# EAGLE design Ghetto distortion 3 - Pablo Martín (EAGLE 8.6.0)
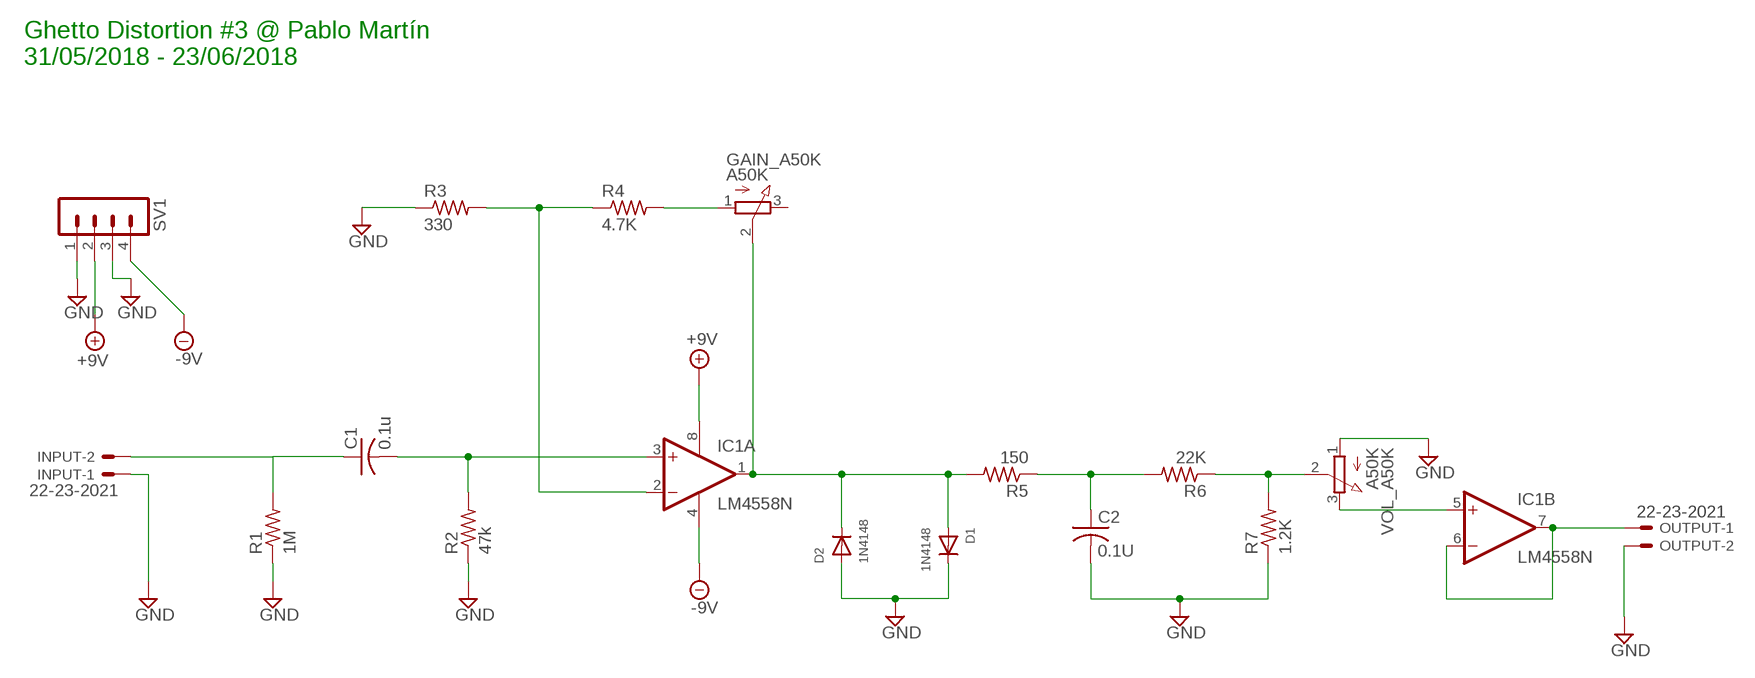
[diagram p0: schematic, sheet 1]

## Parts
C1  0.1u  C-US050-024X044  [C050-024X044]
C2  0.1U  C-US050-024X044  [C050-024X044]
D1  1N4148  DIODEDO-1N4148  [DO-1N4148]
D2  1N4148  DIODEDO-1N4148  [DO-1N4148]
GAIN_A50K  A50K  3RP/1610N  [3RP/1610N]
IC1  LM4558N  [DIL08]
INPUT  22-23-2021  [22-23-2021]
OUTPUT  22-23-2021  [22-23-2021]
R1  1M  R-US_0204/7  [0204/7]
R2  47k  R-US_0204/7  [0204/7]
R3  330  R-US_0204/7  [0204/7]
R4  4.7K  R-US_0204/7  [0204/7]
R5  150  R-US_0204/7  [0204/7]
R6  22K  R-US_0204/7  [0204/7]
R7  1.2K  R-US_0204/7  [0204/7]
SV1  MA04-1  [MA04-1]
VOL_A50K  A50K  3RP/1610N  [3RP/1610N]

## Nets
+9V: IC1.8(P:V+) SV1.2
-9V: IC1.4(P:V-) SV1.4
GND: C2.2 D1.C D2.A INPUT.1 OUTPUT.2 R1.1 R2.1 R3.1 R7.1 SV1.1 SV1.3 VOL_A50K.1(A)
N$1: C1.2 IC1.3(A:+IN) R2.2
N$2: C1.1 INPUT.2 R1.2
N$3: IC1.2(A:-IN) R3.2 R4.1
N$4: D1.A D2.C GAIN_A50K.2(S) IC1.1(A:OUT) R5.2
N$5: R6.1 R7.2 VOL_A50K.2(S)
N$6: IC1.5(B:+IN) VOL_A50K.3(E)
N$7: GAIN_A50K.1(A) R4.2
N$8: IC1.6(B:-IN) IC1.7(B:OUT) OUTPUT.1
N$9: C2.1 R5.1 R6.2
Unconnected: GAIN_A50K.3(E)

## Notes on the sheet
- Ghetto Distortion #3 @ Pablo Martín
  31/05/2018 - 23/06/2018

## Library data of the parts
C1 C2 = resistor:C-US: CAPACITOR, American symbol
D1 D2 = adafruit:DIODE: Diode SMADIODE - SMA Surface Mount Package 20V 1A Schottky Diode Digikey: 641-1014-6-ND DO-1N4148 - Through Hole Small Current Diode SOD-123 20V 1 A (.5mV Vf) Schottky Diode - Digikey: MBRX120TPMSCT-ND SOD-323 10V 570mA (.38mV Vf, 3ns) Schottky Diode - Digikey: ZLLS410CT-ND SOD-523 30V 30mA Schottky Diode (RB751S-40TE61) - Digikey: RB751S-40TE61CT-ND SOT23-R/W - SOT23 Package (R = Solder Paste/Reflow Ovens, W = Hand-Soldering) BAT54Film 40V 300mA - Digikey: 497-7162-1-ND
GAIN_A50K VOL_A50K = pot:3RP/1610N: 16mm Potentiometer one level Source: http://www.alphapotentiometers.net/html/16mm_pot_2.html
IC1 = linear:*4558: OP AMP; SPICEPREFIX: J
INPUT OUTPUT = con-molex:22-23-2021: .100" (2.54mm) Center Header - 2 Pin; MF: MOLEX; MPN: 22-23-2021; OC_FARNELL: 1462926; OC_NEWARK: 25C3832
R1-R7 = resistor:R-US_: RESISTOR, American symbol
SV1 = con-lstb:MA04-1: PIN HEADER; OC_FARNELL: unknown; OC_NEWARK: unknown

## Net classes
0 default: clearance 0.205 mm

## Board
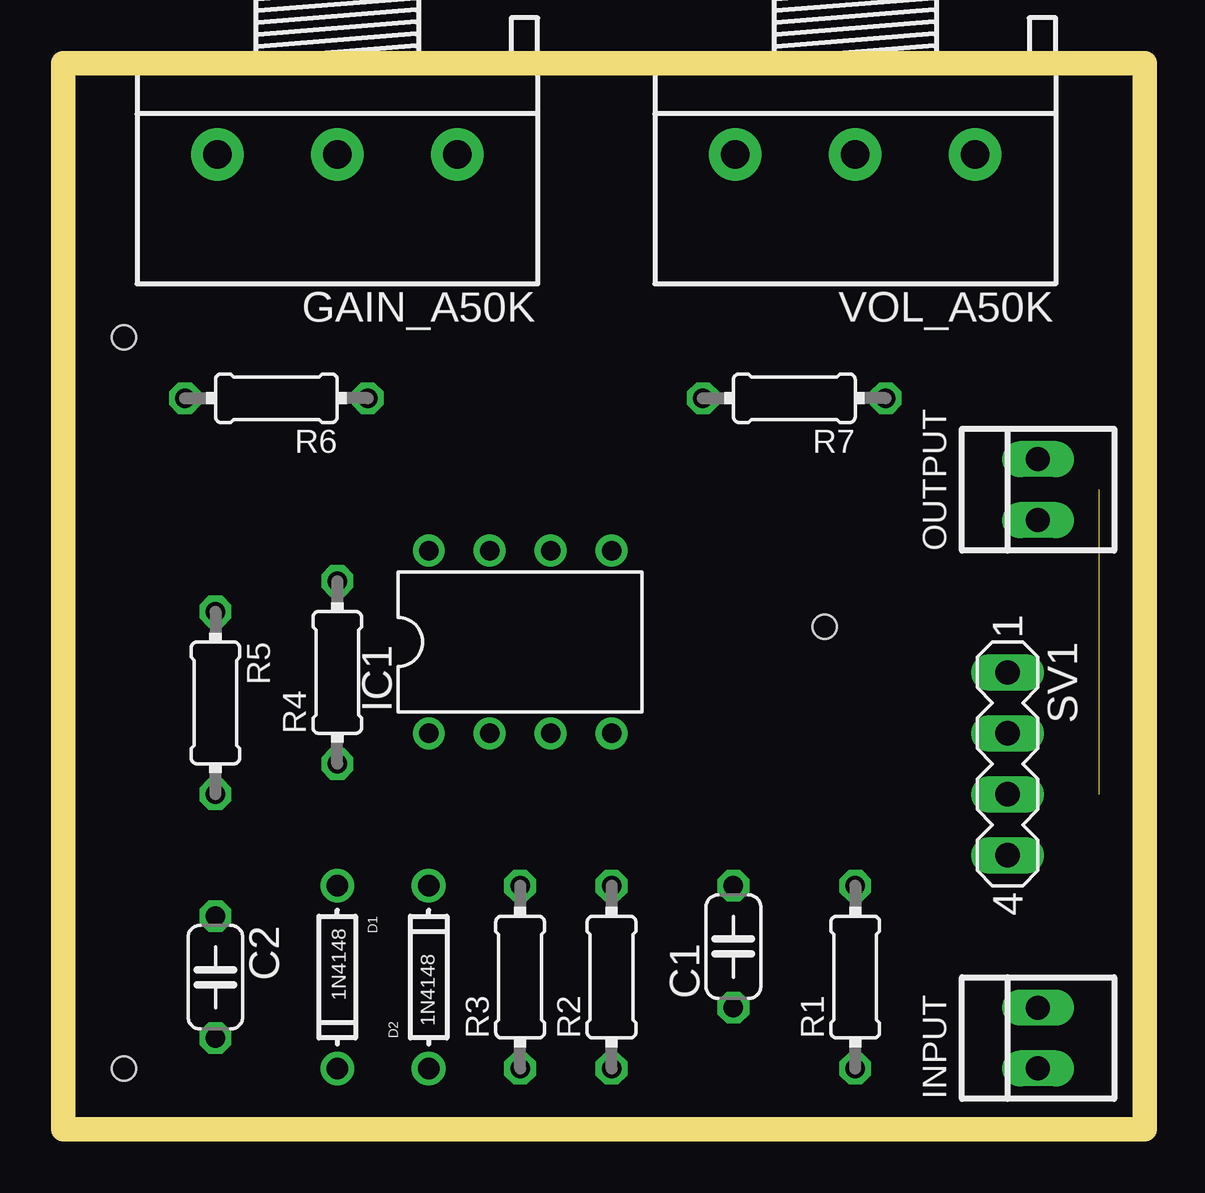
[diagram p1: board, top side]
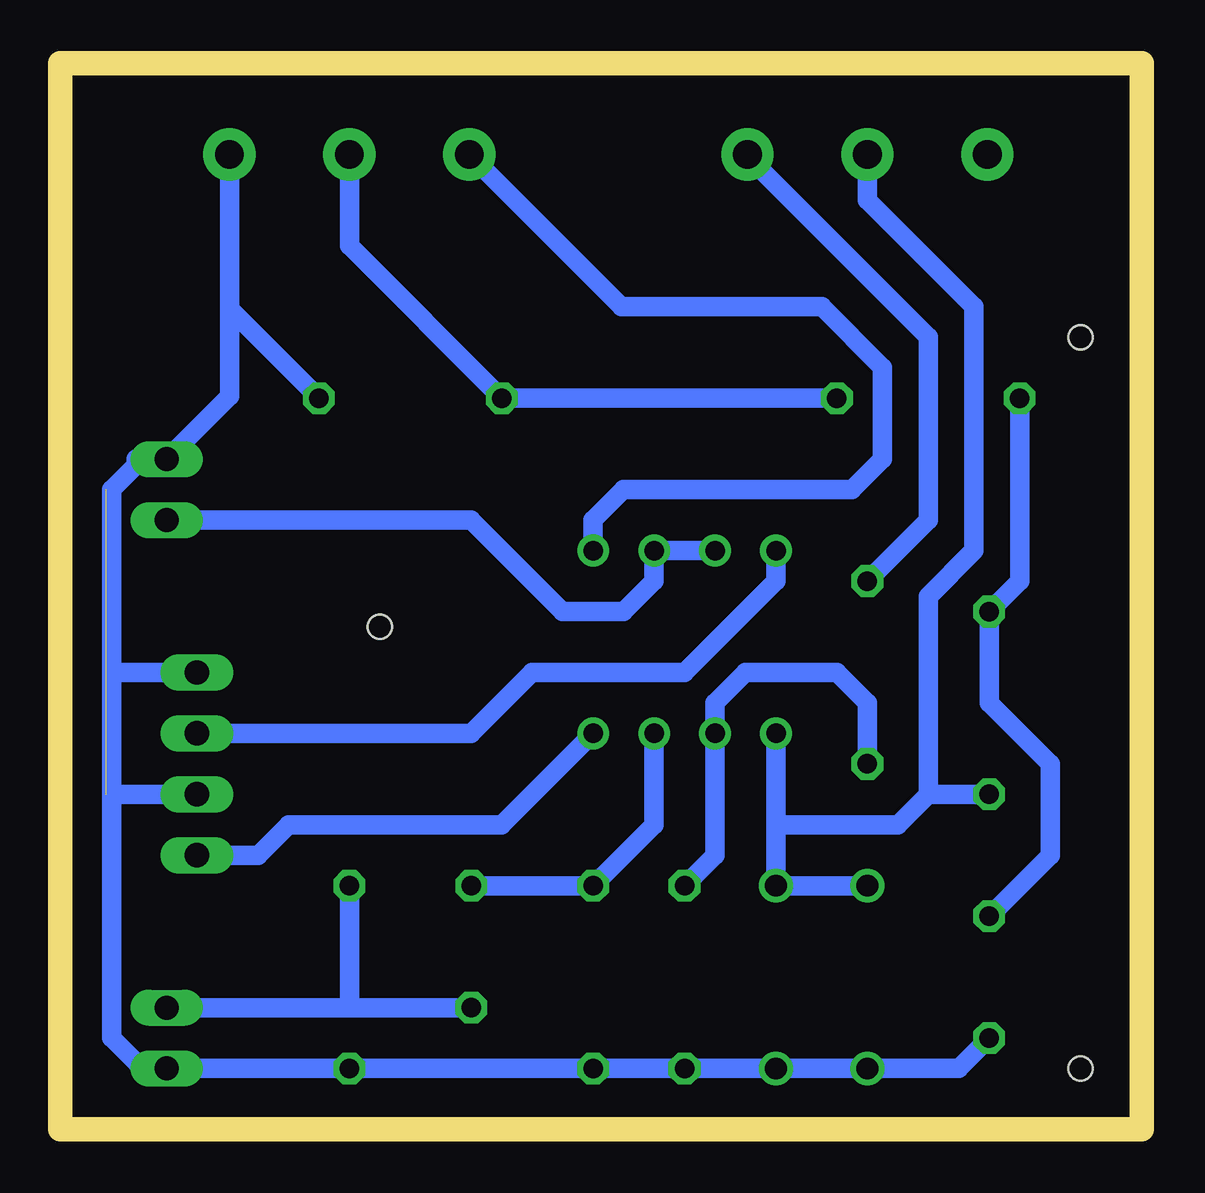
[diagram p2: board, bottom side, seen from below]

Size 45.09 x 44.45 mm. Coordinates in mm from the lower left corner, seen from the top.
Outline: 0,0 45.09,0 45.09,44.45 0,44.45 0,0
Copper layers (1*16): Top 0.035mm / dielectric 1.5mm / Bottom 0.035mm
Design rules "default": minimum track width 6mil, minimum drill 0.35mm, track to track 6mil, track to pad 6mil, pad to pad 6mil, via to via 6mil, smd to smd 6mil, copper to edge 40mil, drill to drill 6mil, minimum pad ring 10mil, minimum via ring 8mil, stop-mask expansion 4mil, vias tented up to drill 0mil, thermal gap 10mil
Holes 1 mm at 2.54,2.54 31.75,20.95 2.54,33.02

### Footprints (pad centres in the part's own frame; a part is rotated, then mirrored left to right if it is on the bottom)
C050-024X044 = drill 0.813 octagon: 1 -2.54,0; 2 2.54,0
DO-1N4148 = drill 0.9: A -3.81,0; C 3.81,0
3RP/1610N = drill 1.2 pad 2.184: 1 -5,0; 2 0,0; 3 5,0
DIL08 = drill 0.813 pad 1.27: 1 -3.81,-3.81; 2 -1.27,-3.81; 3 1.27,-3.81; 4 3.81,-3.81; 5 3.81,3.81; 6 1.27,3.81; 7 -1.27,3.81; 8 -3.81,3.81
22-23-2021 = drill 1 long: 1 -1.27,0; 2 1.27,0
0204/7 = drill 0.813 octagon: 1 -3.81,0; 2 3.81,0
MA04-1 = drill 1.016 long: 1 -3.81,0; 2 -1.27,0; 3 1.27,0; 4 3.81,0

### Placement (x,y rotation side)
C1  27.94,7.62 90 top
C2  6.35,6.35 270 top
D1  11.43,6.35 270 top
D2  15.24,6.35 90 top
GAIN_A50K  11.43,40.64 180 top
IC1  19.05,20.32 0 top
INPUT  40.64,3.81 90 top
OUTPUT  40.64,26.67 90 top
R1  33.02,6.35 90 top
R2  22.86,6.35 90 top
R3  19.05,6.35 90 top
R4  11.43,19.05 90 top
R5  6.35,17.78 270 top
R6  8.89,30.48 180 top
R7  30.48,30.48 180 top
SV1  39.37,15.24 270 top
VOL_A50K  33.02,40.64 180 top

### Tracks (layer width: path | path; a pad name or v marks a point on that pad's centre or on a via)
+9V
  Bottom 0.813: IC1.8 15.24,22.86 19.05,19.05 25.4,19.05 27.94,16.51 SV1.2
-9V
  Bottom 0.813: SV1.4 36.83,11.43 35.56,12.7 26.67,12.7 IC1.4
GND  (1 unrouted)
  Bottom 0.152: R1.1 24.13,2.54 R2.1 R3.1 | 42.93,13.97 43.18,13.97 43.18,3.81 | OUTPUT.2 43.18,26.67
  Bottom 0.813: C2.2 7.62,2.54 D1.C D2.A R3.1 24.13,2.54 | R2.1 R1.1 INPUT.1 41.66,2.54 42.93,3.81 42.93,13.97 | 42.93,13.97 42.93,19.05 | 42.93,19.05 42.93,26.67 41.91,27.69 41.91,27.94 OUTPUT.2 38.02,30.56 38.02,34.21 | SV1.1 42.93,19.05 | SV1.3 42.93,13.97 | R7.1 38.02,34.21 | 38.02,34.21 VOL_A50K.1
N$1
  Bottom 0.813: C1.2 R2.2 20.32,12.7 IC1.3
N$2
  Bottom 0.813: INPUT.2 33.02,5.08 | 33.02,5.08 C1.1 | R1.2 33.02,5.08
N$3
  Bottom 0.813: R3.2 17.78,11.43 IC1.2 17.78,17.78 16.51,19.05 12.7,19.05 11.43,17.78 R4.1
N$4
  Top 0.152: 6.35,15.24 R5.2
  Bottom 0.813: D1.A D2.C 15.24,12.7 | 15.24,12.7 IC1.1 | 8.89,13.97 8.89,22.23 6.98,24.13 6.98,34.29 11.43,38.73 GAIN_A50K.2 | 8.89,13.97 R5.2 | 8.89,13.97 10.16,12.7 15.24,12.7
N$5
  Bottom 0.813: R6.1 R7.2 33.02,36.83 VOL_A50K.2
N$6
  Bottom 0.813: VOL_A50K.3 21.67,34.29 13.33,34.29 10.79,31.75 10.79,27.94 12.06,26.67 21.59,26.67 22.86,25.4 IC1.5
N$7
  Bottom 0.813: GAIN_A50K.1 16.43,40.56 8.89,33.02 8.89,25.4 R4.2
N$8
  Bottom 0.813: IC1.7 IC1.6 20.32,22.86 21.59,21.59 24.13,21.59 27.94,25.4 OUTPUT.1
N$9
  Bottom 0.813: R6.2 5.08,22.86 R5.1 6.35,17.78 3.81,15.24 3.81,11.43 C2.1
(copper drawn outside any net)
  shapes: Top area x2